# Altium project roach2_project rev2.PrjPCB (part 1 of 13)
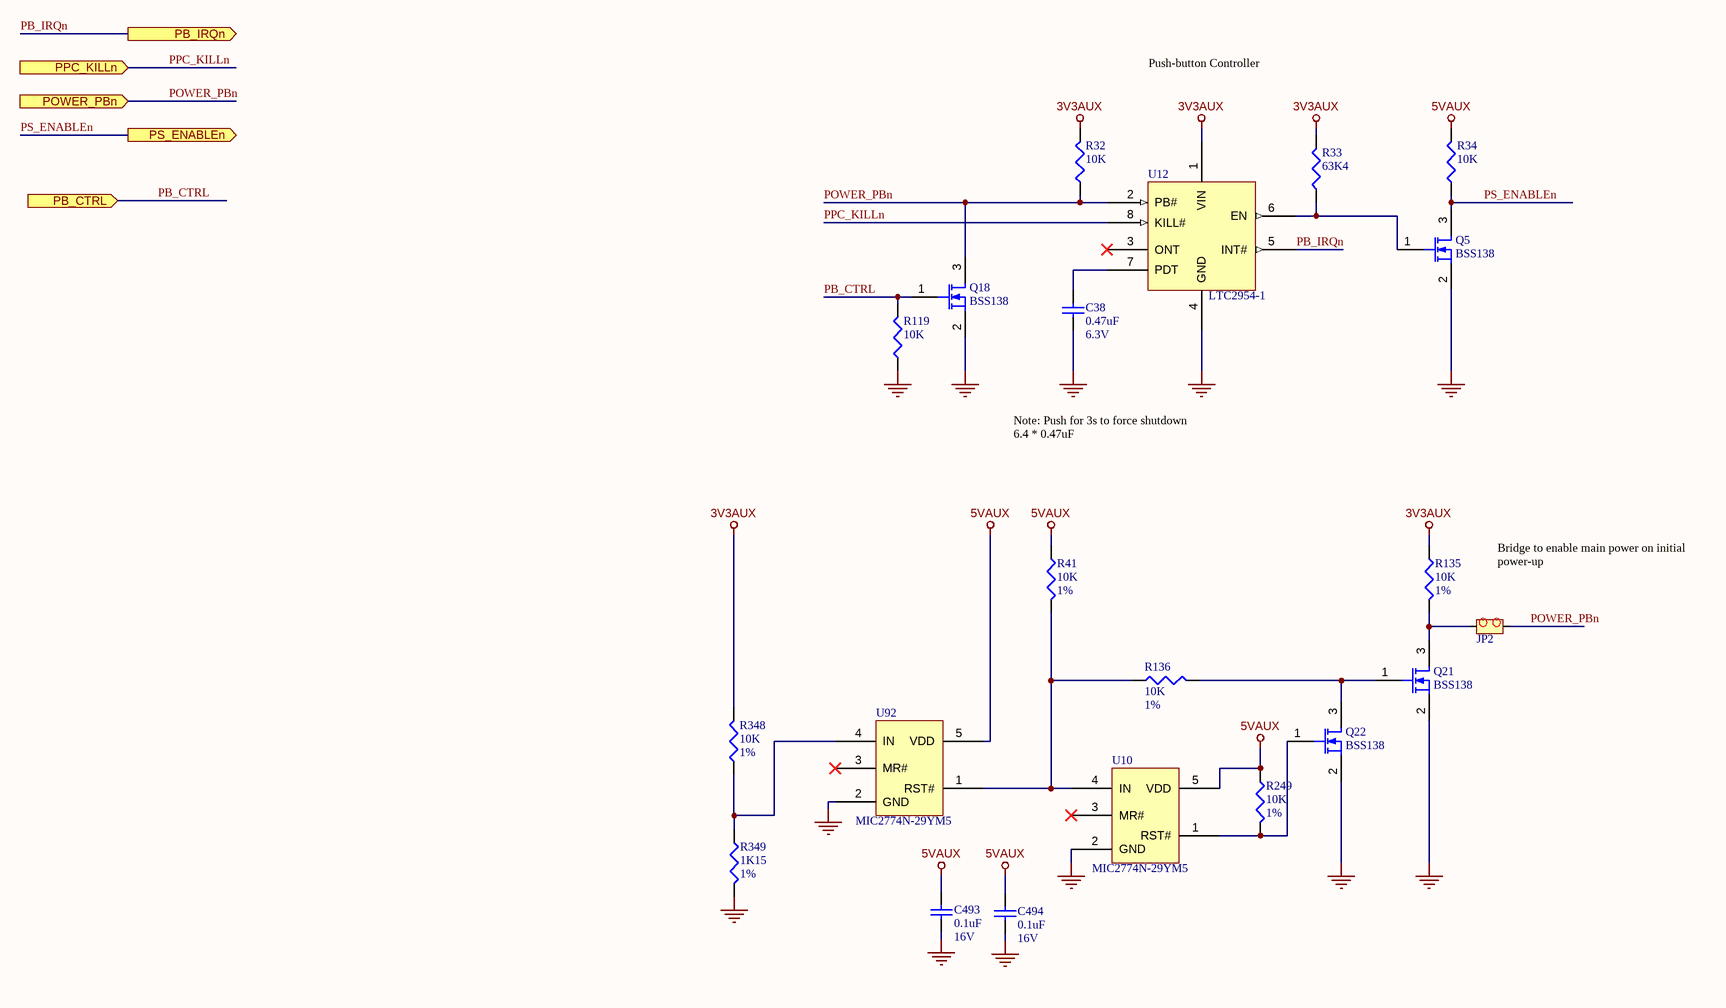
[diagram p0: hwmon_2.SchDoc]
COMPANY_ADDRESS_1: 17 Baker Street, Rosebank; COMPANY_ADDRESS_2: Johannesburg; COMPANY_ADDRESS_3: South Africa; COMPANY_NAME1: Square Kilometer Array; COMPANY_NAME2: MeerKAT; COPYRIGHT_YEAR: 2011; GERBER FILENAME: 1111-2222; PCB_REVISION: 2.A; PCB_Title_Date: 14-08-2010; PCB_Title_DocumentNumber: 1111-2222P; PCB_Title_DrawnBy: A. A.; PCB_Title_Engineer: B. B.; PCB_Title_Filename: roach2.PcbDoc; PROJECT_TITLE: ROACH 2; SCH_Title_Date: 14-2-2012; SCH_Title_DrawnBy: Philip Gibbs; SCH_Title_Engineer: David George; SCH_Title_SheetTotal: 29
25 sheets, 1337 parts. Net scope: hierarchical (ports join the sheet entries above them; power ports are global).
Board file: roach2.PcbDoc
Sheets:
  hwmon_2.SchDoc
  roach2_top.SchDoc
    DDR3 = ddr3.SchDoc
    GPIO_LED = gpio_led.SchDoc
    JTAG_LEVELXLATE = jtag_levelxlate.SchDoc
    POWER_SUPPLY = power_supply.SchDoc
    PPC_CPLD = ppc_cpld.SchDoc
    PPC_EXTBUS = ppc_extbus.SchDoc
    PPC_NET = ppc_net.SchDoc
    PPC_SERIAL = ppc_serial.SchDoc
    PPC_SYS = ppc_sys.SchDoc
    QDR0_1 = qdr0_1.SchDoc
    QDR2_3 = qdr2_3.SchDoc
    V6_CONFIG_IO_16_17_21_22 = v6_config_io_16_17_21_22.SchDoc
    V6_IO_12_13_14_15 = v6_io_12_13_14_15.SchDoc
    V6_IO_23_24_25_26 = v6_io_23_24_25_26.SchDoc
    V6_IO_27_28_32_33 = v6_io_27_28_32_33.SchDoc
    V6_IO_34_35_36_37_38 = v6_io_34_35_36_37_38.SchDoc
    ZDOKS = zdoks.SchDoc
    PPC_POWER = ppc_power.SchDoc
    MGT_BREAKOUT = mgt_breakout.SchDoc
    V6_NET = v6_net.SchDoc
    PPC_DDR_0 = ppc_ddr2_0.SchDoc
    PPC_DDR_1 = ppc_ddr2_1.SchDoc
    Miscallaneous = misc.SchDoc

## Sheet hwmon_2.SchDoc: Hardware Monitoring
size A3; Date: DO NOT USE, RATHER USE PROJ OPTIONS; DrawnBy: DO NOT USE, RATHER USE PROJ OPTIONS; Engineer: DO NOT USE, RATHER USE PROJ OPTIONS; Organization: DO NOT USE, RATHER USE PROJ OPTIONS; DocumentNumber: DO NOT USE, RATHER USE PROJ OPTIONS; Revision: DO NOT USE, RATHER USE PROJ OPTIONS; SheetNumber: 28; SheetTotal: 29; SCH_Sheet_Filename: hwmon_2.SchDoc; CurrentTime: DO NOT USE, RATHER USE PROJ OPTIONS; Time: DO NOT USE, RATHER USE PROJ OPTIONS; DocumentFullPathAndName: DO NOT USE, RATHER USE PROJ OPTIONS; DocumentName: DO NOT USE, RATHER USE PROJ OPTIONS; ModifiedDate: DO NOT USE, RATHER USE PROJ OPTIONS; ImagePath: DO NOT USE, RATHER USE PROJ OPTIONS

### Parts
(Parts that share a designator on the sheet are numbered #1, #2 ... from top to bottom, then left to right.)
C38  value 0.47uF  Rating: 6.3V  [CAPC1005X55L]  (hidden comment: CapStd)
C493  Rating: 16V  [CAPC1005X60L]  (hidden comment: 0.1uF)
C494  Rating: 16V  [CAPC1005X60L]  (hidden comment: 0.1uF)
JP2  0022032021  [MOLEX_0022032021]  (value not drawn)
Q5  BSS138  [SOT95P245X110-3N]
Q18  BSS138  [SOT95P245X110-3N]
Q21  BSS138  [SOT95P245X110-3N]
Q22  BSS138  [SOT95P245X110-3N]
R32  10K  [RESC1005X40L]
R33  63K4  [RESC1005X40L]
R34  10K  [RESC1005X40L]
R41  Tolerance: 1%  [RESC1005X40L]  (hidden comment: 10K)
R119  10K  [RESC1005X40L]
R135#1  Tolerance: 1%  [RESC1005X40L]  (hidden comment: 10K)
R136#1  Tolerance: 1%  [RESC1005X40L]  (hidden comment: 10K)
R249  Tolerance: 1%  [RESC1005X40L]  (hidden comment: 10K)
R348  Tolerance: 1%  [RESC1005X40L]  (hidden comment: 10K)
R349  Tolerance: 1%  [RESC1005X40L]  (hidden comment: 1K15)
U10  MIC2774N-29YM5  [SOT23-5]
U12  LTC2954-1  [TSOT-23-8]
U92  MIC2774N-29YM5  [SOT23-5]

### Ports
PB_CTRL (in), PB_IRQn (out), POWER_PBn (in), PPC_KILLn (in), PS_ENABLEn (out)

### Nets
3V3AUX: R32.2 R33.2 R135#1.1 R348.2 U12.1(VIN)
5VAUX: C493.2 C494.2 R34.2 R41.1 R249.1 U10.5(VDD) U92.5(VDD)
GND: C38.2 C493.1 C494.1 Q5.2(S) Q18.2(S) Q21.2(S) Q22.2(S) R119.1 R349.2 U10.2(GND) U12.4(GND) U92.2(GND)
PB_CTRL: Q18.1(G) R119.2 ; port PB_CTRL
PB_IRQn: U12.5(INT#) ; port PB_IRQn
POWER_PBn: JP2.2 Q18.3(D) R32.1 U12.2(PB#) ; port POWER_PBn
PPC_KILLn: U12.8(KILL#) ; port PPC_KILLn
PS_ENABLEn: Q5.3(D) R34.1 ; port PS_ENABLEn
NetC38_1: C38.1 U12.7(PDT)
NetJP2_1: JP2.1 Q21.3(D) R135#1.2
NetQ5_1: Q5.1(G) R33.1 U12.6(EN)
NetQ21_1: Q21.1(G) Q22.3(D) R136#1.2
NetQ22_1: Q22.1(G) R249.2 U10.1(RST#)
NetR41_2: R41.2 R136#1.1 U10.4(IN) U92.1(RST#)
NetR348_1: R348.1 R349.1 U92.4(IN)

Not connected (* = marked no-connect by the designer): U10 3(MR#)*; U12 3(ONT)*; U92 3(MR#)*

### Notes on the sheet
- Push-button Controller
- Note: Push for 3s to force shutdown
  6.4 * 0.47uF
- Bridge to enable main power on initial power-up
- 2009   THIS DOCUMENT IS THE PROPERTY OF THE OWNER, AND MAY NOT BE COPIED OR USED FOR ANY PURPOSE OTHER THAN THAT FOR WHICH IT IS SUPPLIED WITHOUT PERMISSION IN WRITING FROM THE OWNER.
- C
- DATESTAMP OF THIS PRINT
- DRAWN BY:
- DOCUMENT NUMBER:
- SCHEMATIC FILENAME:
- PCB FILENAME:
- ENGINEER:
- APPROVED:
- CIRCUIT DIAGRAM
- DATE
- SHEET
- REVISION
- OF

### Library data of the parts
C38 = CAP-CER-7: 0.47uF, Ceramic Capacitor; POD number: CAP-CER-7
C493 C494 = CAP-CER-1: 0.1uF, Ceramic Capacitor; Manufacturer: VENKEL; PartNum: C0402X7R160-104KN; Tolerance: 10%; Dielectric: X7R; POD number: CAP-CER-1; Value: 0.1uF; RoHS: Y; Sort Value: 0.1; Category: Capacitors; Subcategory: Ceramic
JP2 = CONN-PCB-14: 1x2, 2.56mm, Header/Jumper; Manufacturer: Molex; POD number: CONN-PCB-14; PartNum: 0022032021; RoHS: Y; Category: CONN; Subcategory: PCB
Q5 Q18 Q21 Q22 = TRANS-NFET-0: N-Channel Logic Level Enhancement Mode Field Effect Transistor; Manufacturer: Fairchild Semiconductor; Rating: 0.22A; POD number: TRANS-NFET-0; PartNum: BSS138; RoHS: Y; Category: TRANS; Subcategory: NFET
R32 R34 R119 = RES-TF-5: 10K, 1.1mm x 0.5mm, Thick Film Resistor; Manufacturer: ROYALOHM; PartNum: 0402WGJ0103T1E; Tolerance: 5%; Rating: 0.0625W; POD number: RES-TF-5; Value: 10K; Sort Value: 10000; Category: Resistors; Subcategory: ThickFilm; HelpURL: *.pdf
R33 = RES-TF-33: 63K4, 1.1mm x 0.5mm, Thick Film Resistor; Manufacturer: ROYALOHM; PartNum: 0402WGF6342T1E; Tolerance: 1%; Rating: 0.0625W; POD number: RES-TF-33; Value: 63K4; Sort Value: 63400; Category: Resistors; Subcategory: ThickFilm; HelpURL: *.pdf
R41 R135#1 R136#1 R249 R348 = RES-TF-20: 10K, 1.1mm x 0.5mm, Thick Film Resistor; Manufacturer: ROYALOHM; PartNum: 0402WGF0103T1E; Rating: 0.0625W; POD number: RES-TF-20; Value: 10K; Sort Value: 10000; Category: Resistors; Subcategory: ThickFilm; HelpURL: http://www.royalohm.com/pdf/general.pdf
R349 = RES-TF-28: 1K15, 1.1mm x 0.5mm, Thick Film Resistor; Manufacturer: ROYALOHM; PartNum: 0402WGF1150T1E; Rating: 0.0625W; POD number: RES-TF-28; Value: 1K15; Sort Value: 1150; Category: Resistors; Subcategory: ThickFilm; HelpURL: *.pdf
U10 U92 = IC-MON-4: Dual-power low voltage supervisor; Manufacturer: Micrel; POD number: IC-MON-4; PartNum: MIC2774N-29YM5; RoHS: Y; Category: IC; Subcategory: Monitoring
U12 = IC-MON-8: Push Button On/Off Controller; POD number: IC-MON-8

## Sheet roach2_top.SchDoc: Design Toplevel
size A3; Date: DO NOT USE, RATHER USE PROJ OPTIONS; DrawnBy: DO NOT USE, RATHER USE PROJ OPTIONS; Engineer: DO NOT USE, RATHER USE PROJ OPTIONS; Organization: DO NOT USE, RATHER USE PROJ OPTIONS; DocumentNumber: DO NOT USE, RATHER USE PROJ OPTIONS; Revision: DO NOT USE, RATHER USE PROJ OPTIONS; SheetNumber: 1; SheetTotal: 27; SCH_Sheet_Filename: <roach2_top.SchDoc>; CurrentTime: DO NOT USE, RATHER USE PROJ OPTIONS; Time: DO NOT USE, RATHER USE PROJ OPTIONS; DocumentFullPathAndName: DO NOT USE, RATHER USE PROJ OPTIONS; DocumentName: DO NOT USE, RATHER USE PROJ OPTIONS; ModifiedDate: DO NOT USE, RATHER USE PROJ OPTIONS; ImagePath: DO NOT USE, RATHER USE PROJ OPTIONS
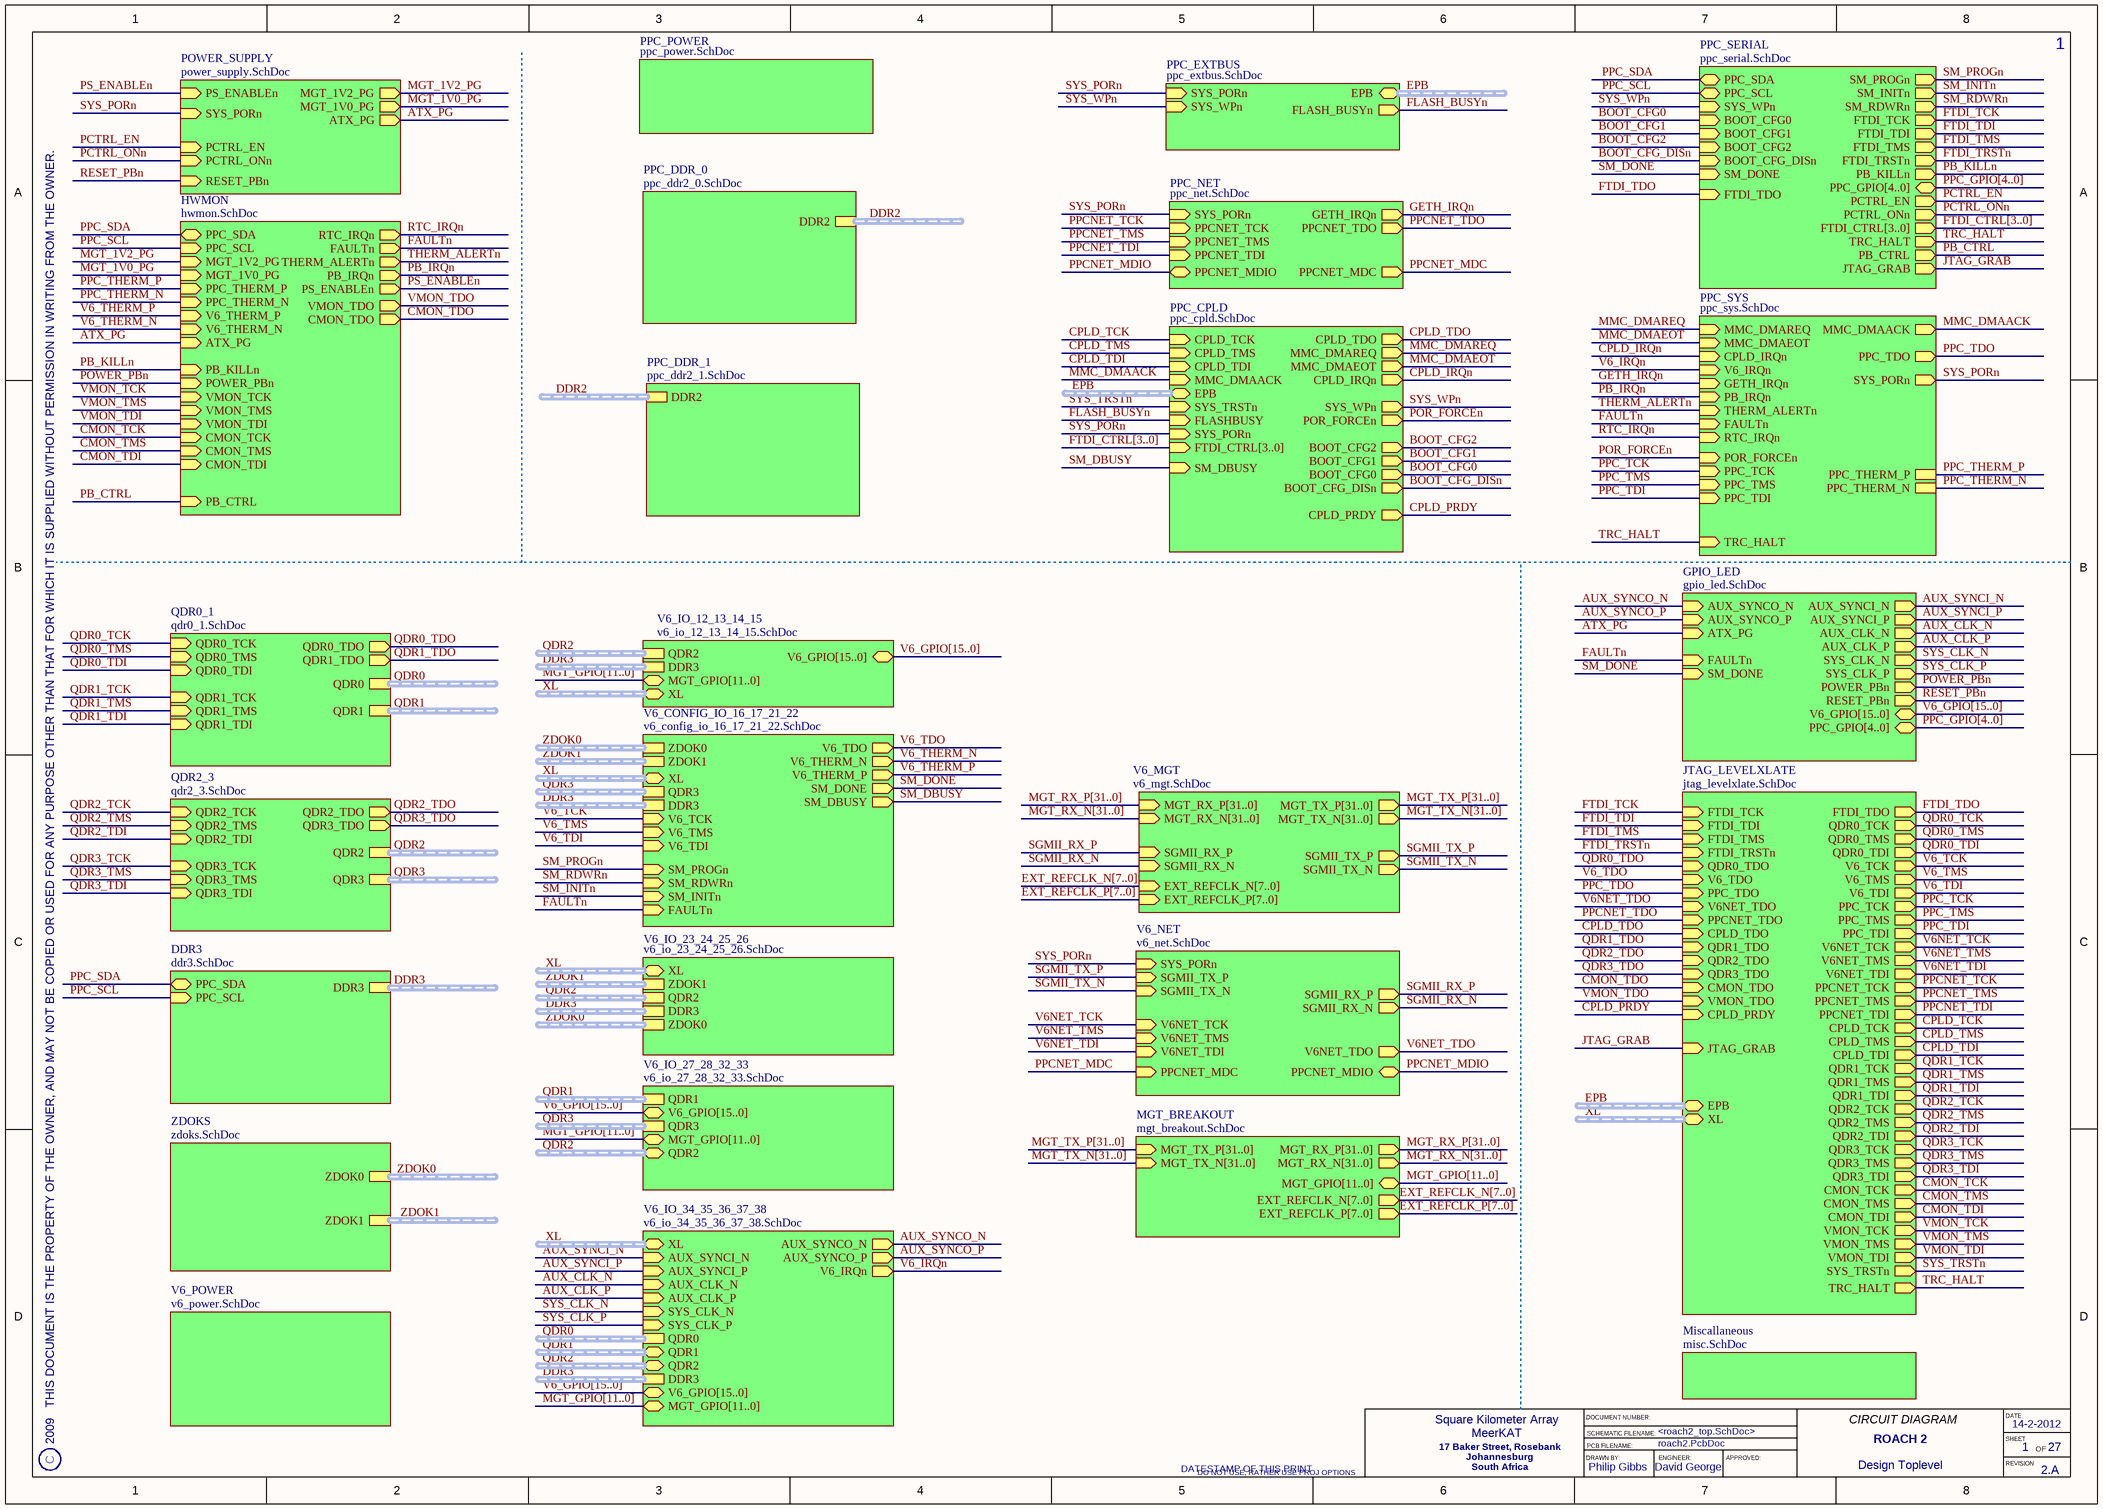
[diagram p1: roach2_top.SchDoc]

### Sub-sheets
DDR3 = ddr3.SchDoc: DDR3 (harness DDR3), PPC_SDA (bidir), PPC_SCL (in)
GPIO_LED = gpio_led.SchDoc: V6_GPIO[15..0] (bidir), AUX_SYNCO_N (in), AUX_SYNCO_P (in), AUX_SYNCI_N (out), AUX_SYNCI_P (out), AUX_CLK_N (out), AUX_CLK_P (out), POWER_PBn (out), ATX_PG (in), RESET_PBn (out), PPC_GPIO[4..0] (bidir), SYS_CLK_N (out), SYS_CLK_P (out), SM_DONE (in), FAULTn (in)
HWMON = hwmon.SchDoc (file not in this document): PPC_SDA (bidir), PPC_SCL (in), RTC_IRQn (out), MGT_1V2_PG (in), MGT_1V0_PG (in), PPC_THERM_P (in), PPC_THERM_N (in), V6_THERM_P (in), V6_THERM_N (in), FAULTn (out), THERM_ALERTn (out), ATX_PG (in), PB_IRQn (out), PB_KILLn (in), POWER_PBn (in), PS_ENABLEn (out), VMON_TDO (out), CMON_TDO (out), VMON_TCK (in), VMON_TMS (in), VMON_TDI (in), CMON_TCK (in), CMON_TMS (in), CMON_TDI (in), PB_CTRL (in)
JTAG_LEVELXLATE = jtag_levelxlate.SchDoc: FTDI_TCK (in), FTDI_TDI (in), FTDI_TMS (in), FTDI_TRSTn (in), FTDI_TDO (out), QDR0_TCK (out), QDR0_TMS (out), QDR0_TDI (out), QDR0_TDO (in), V6_TCK (out), V6_TDI (out), V6_TMS (out), V6_TDO (in), PPC_TDI (out), PPC_TDO (in), PPC_TMS (out), PPC_TCK (out), V6NET_TDI (out), V6NET_TDO (in), V6NET_TCK (out), V6NET_TMS (out), PPCNET_TDI (out), PPCNET_TDO (in), PPCNET_TCK (out), PPCNET_TMS (out), CPLD_TDI (out), CPLD_TDO (in), CPLD_TCK (out), CPLD_TMS (out), QDR1_TCK (out), QDR1_TMS (out), QDR1_TDI (out), QDR1_TDO (in), QDR2_TCK (out), QDR2_TMS (out), QDR2_TDI (out), QDR2_TDO (in), QDR3_TCK (out), QDR3_TMS (out), QDR3_TDI (out), QDR3_TDO (in), SYS_TRSTn (out), CMON_TMS (out), VMON_TMS (out), CMON_TCK (out), VMON_TCK (out), CMON_TDO (in), VMON_TDO (in), CMON_TDI (out), VMON_TDI (out), EPB (harness EPB), XL (harness XL), CPLD_PRDY (in), TRC_HALT (out), JTAG_GRAB (in)
MGT_BREAKOUT = mgt_breakout.SchDoc: MGT_RX_P[31..0] (out), MGT_RX_N[31..0] (out), MGT_TX_P[31..0] (in), MGT_TX_N[31..0] (in), MGT_GPIO[11..0] (bidir), EXT_REFCLK_N[7..0] (out), EXT_REFCLK_P[7..0] (out)
Miscallaneous = misc.SchDoc: no entries
POWER_SUPPLY = power_supply.SchDoc: PS_ENABLEn (in), MGT_1V2_PG (out), MGT_1V0_PG (out), ATX_PG (out), SYS_PORn (in), PCTRL_EN (in), PCTRL_ONn (in), RESET_PBn (in)
PPC_CPLD = ppc_cpld.SchDoc: CPLD_TDI (in), CPLD_TDO (out), CPLD_TCK (in), CPLD_TMS (in), MMC_DMAREQ (out), MMC_DMAACK (in), MMC_DMAEOT (out), CPLD_IRQn (out), SYS_TRSTn (in), SYS_WPn (out), FLASHBUSY (in), POR_FORCEn (out), BOOT_CFG_DISn (out), BOOT_CFG2 (out), BOOT_CFG1 (out), BOOT_CFG0 (out), SYS_PORn (in), EPB (harness EPB), FTDI_CTRL[3..0] (in), CPLD_PRDY (out), SM_DBUSY (in)
PPC_DDR_0 = ppc_ddr2_0.SchDoc: DDR2 (harness DDR2)
PPC_DDR_1 = ppc_ddr2_1.SchDoc: DDR2 (harness DDR2)
PPC_EXTBUS = ppc_extbus.SchDoc: SYS_PORn (in), SYS_WPn (in), FLASH_BUSYn (out), EPB (harness EPB)
PPC_NET = ppc_net.SchDoc: SYS_PORn (in), GETH_IRQn (out), PPCNET_TDI (in), PPCNET_TDO (out), PPCNET_TCK (in), PPCNET_TMS (in), PPCNET_MDIO (bidir), PPCNET_MDC (out)
PPC_POWER = ppc_power.SchDoc: no entries
PPC_SERIAL = ppc_serial.SchDoc: PPC_SDA (bidir), PPC_SCL (bidir), SYS_WPn (in), BOOT_CFG0 (in), BOOT_CFG1 (in), BOOT_CFG2 (in), BOOT_CFG_DISn (in), SM_PROGn (out), SM_INITn (out), SM_RDWRn (out), FTDI_TCK (out), FTDI_TDI (out), FTDI_TDO (in), FTDI_TMS (out), FTDI_TRSTn (out), PPC_GPIO[4..0] (bidir), SM_DONE (in), PCTRL_EN (out), PCTRL_ONn (out), PB_KILLn (out), FTDI_CTRL[3..0] (out), TRC_HALT (out), PB_CTRL (out), JTAG_GRAB (out)
PPC_SYS = ppc_sys.SchDoc: MMC_DMAREQ (in), MMC_DMAACK (out), MMC_DMAEOT (in), CPLD_IRQn (in), V6_IRQn (in), GETH_IRQn (in), THERM_ALERTn (in), PPC_THERM_P, PPC_THERM_N, POR_FORCEn (in), PPC_TCK (in), PPC_TDO (out), PPC_TMS (in), PPC_TDI (in), FAULTn (in), SYS_PORn (out), PB_IRQn (in), RTC_IRQn (in), TRC_HALT (in)
QDR0_1 = qdr0_1.SchDoc: QDR0 (harness QDR0), QDR0_TCK (in), QDR0_TMS (in), QDR0_TDI (in), QDR0_TDO (out), QDR1 (harness QDR1), QDR1_TCK (in), QDR1_TMS (in), QDR1_TDI (in), QDR1_TDO (out)
QDR2_3 = qdr2_3.SchDoc: QDR2 (harness QDR2), QDR2_TCK (in), QDR2_TMS (in), QDR2_TDI (in), QDR2_TDO (out), QDR3 (harness QDR3), QDR3_TCK (in), QDR3_TMS (in), QDR3_TDI (in), QDR3_TDO (out)
V6_CONFIG_IO_16_17_21_22 = v6_config_io_16_17_21_22.SchDoc: ZDOK0 (harness ZDOK0), QDR3 (harness QDR3), DDR3 (harness DDR3), V6_TCK (in), V6_TDI (in), V6_TMS (in), V6_TDO (out), V6_THERM_N (out), V6_THERM_P (out), SM_PROGn (in), SM_RDWRn (in), SM_INITn (in), SM_DONE (out), XL (harness XL), FAULTn (in), ZDOK1 (harness ZDOK1), SM_DBUSY (out)
V6_IO_12_13_14_15 = v6_io_12_13_14_15.SchDoc: QDR2 (harness QDR2), DDR3 (harness DDR3), MGT_GPIO[11..0] (bidir), XL (harness XL), V6_GPIO[15..0] (bidir)
V6_IO_23_24_25_26 = v6_io_23_24_25_26.SchDoc: ZDOK1 (harness ZDOK1), QDR2 (harness QDR2), DDR3 (harness DDR3), ZDOK0 (harness ZDOK0), XL (harness XL)
V6_IO_27_28_32_33 = v6_io_27_28_32_33.SchDoc: QDR1 (harness QDR1), V6_GPIO[15..0] (bidir), QDR3 (harness QDR3), MGT_GPIO[11..0] (bidir), QDR2 (harness QDR2)
V6_IO_34_35_36_37_38 = v6_io_34_35_36_37_38.SchDoc: AUX_SYNCO_N (out), AUX_SYNCO_P (out), AUX_SYNCI_N (in), AUX_SYNCI_P (in), V6_IRQn (out), AUX_CLK_N (in), AUX_CLK_P (in), SYS_CLK_N (in), SYS_CLK_P (in), QDR0 (harness QDR0), V6_GPIO[15..0] (bidir), MGT_GPIO[11..0] (bidir), QDR2 (harness QDR2), DDR3 (harness DDR3), QDR1 (harness QDR1), XL (harness XL)
V6_MGT = v6_mgt.SchDoc (file not in this document): MGT_RX_P[31..0] (in), MGT_RX_N[31..0] (in), MGT_TX_P[31..0] (out), MGT_TX_N[31..0] (out), SGMII_RX_P (in), SGMII_RX_N (in), SGMII_TX_P (out), SGMII_TX_N (out), EXT_REFCLK_N[7..0] (in), EXT_REFCLK_P[7..0] (in)
V6_NET = v6_net.SchDoc: SYS_PORn (in), SGMII_TX_P (in), SGMII_TX_N (in), V6NET_TDI (in), V6NET_TDO (out), V6NET_TCK (in), V6NET_TMS (in), SGMII_RX_P (out), SGMII_RX_N (out), PPCNET_MDIO (bidir), PPCNET_MDC (in)
V6_POWER = v6_power.SchDoc (file not in this document): no entries
ZDOKS = zdoks.SchDoc: ZDOK0 (harness ZDOK0), ZDOK1 (harness ZDOK1)

### Nets
ATX_PG: sheet GPIO_LED/ATX_PG, sheet HWMON/ATX_PG, sheet POWER_SUPPLY/ATX_PG
AUX_CLK_N: sheet GPIO_LED/AUX_CLK_N, sheet V6_IO_34_35_36_37_38/AUX_CLK_N
AUX_CLK_P: sheet GPIO_LED/AUX_CLK_P, sheet V6_IO_34_35_36_37_38/AUX_CLK_P
AUX_SYNCI_N: sheet GPIO_LED/AUX_SYNCI_N, sheet V6_IO_34_35_36_37_38/AUX_SYNCI_N
AUX_SYNCI_P: sheet GPIO_LED/AUX_SYNCI_P, sheet V6_IO_34_35_36_37_38/AUX_SYNCI_P
AUX_SYNCO_N: sheet GPIO_LED/AUX_SYNCO_N, sheet V6_IO_34_35_36_37_38/AUX_SYNCO_N
AUX_SYNCO_P: sheet GPIO_LED/AUX_SYNCO_P, sheet V6_IO_34_35_36_37_38/AUX_SYNCO_P
BOOT_CFG0: sheet PPC_CPLD/BOOT_CFG0, sheet PPC_SERIAL/BOOT_CFG0
BOOT_CFG1: sheet PPC_CPLD/BOOT_CFG1, sheet PPC_SERIAL/BOOT_CFG1
BOOT_CFG2: sheet PPC_CPLD/BOOT_CFG2, sheet PPC_SERIAL/BOOT_CFG2
BOOT_CFG_DISn: sheet PPC_CPLD/BOOT_CFG_DISn, sheet PPC_SERIAL/BOOT_CFG_DISn
CMON_TCK: sheet HWMON/CMON_TCK, sheet JTAG_LEVELXLATE/CMON_TCK
CMON_TDI: sheet HWMON/CMON_TDI, sheet JTAG_LEVELXLATE/CMON_TDI
CMON_TDO: sheet HWMON/CMON_TDO, sheet JTAG_LEVELXLATE/CMON_TDO
CMON_TMS: sheet HWMON/CMON_TMS, sheet JTAG_LEVELXLATE/CMON_TMS
CPLD_IRQn: sheet PPC_CPLD/CPLD_IRQn, sheet PPC_SYS/CPLD_IRQn
CPLD_PRDY: sheet JTAG_LEVELXLATE/CPLD_PRDY, sheet PPC_CPLD/CPLD_PRDY
CPLD_TCK: sheet JTAG_LEVELXLATE/CPLD_TCK, sheet PPC_CPLD/CPLD_TCK
CPLD_TDI: sheet JTAG_LEVELXLATE/CPLD_TDI, sheet PPC_CPLD/CPLD_TDI
CPLD_TDO: sheet JTAG_LEVELXLATE/CPLD_TDO, sheet PPC_CPLD/CPLD_TDO
CPLD_TMS: sheet JTAG_LEVELXLATE/CPLD_TMS, sheet PPC_CPLD/CPLD_TMS
FAULTn: sheet GPIO_LED/FAULTn, sheet HWMON/FAULTn, sheet PPC_SYS/FAULTn, sheet V6_CONFIG_IO_16_17_21_22/FAULTn
FLASH_BUSYn: sheet PPC_CPLD/FLASHBUSY, sheet PPC_EXTBUS/FLASH_BUSYn
FTDI_TCK: sheet JTAG_LEVELXLATE/FTDI_TCK, sheet PPC_SERIAL/FTDI_TCK
FTDI_TDI: sheet JTAG_LEVELXLATE/FTDI_TDI, sheet PPC_SERIAL/FTDI_TDI
FTDI_TDO: sheet JTAG_LEVELXLATE/FTDI_TDO, sheet PPC_SERIAL/FTDI_TDO
FTDI_TMS: sheet JTAG_LEVELXLATE/FTDI_TMS, sheet PPC_SERIAL/FTDI_TMS
FTDI_TRSTn: sheet JTAG_LEVELXLATE/FTDI_TRSTn, sheet PPC_SERIAL/FTDI_TRSTn
GETH_IRQn: sheet PPC_NET/GETH_IRQn, sheet PPC_SYS/GETH_IRQn
JTAG_GRAB: sheet JTAG_LEVELXLATE/JTAG_GRAB, sheet PPC_SERIAL/JTAG_GRAB
MGT_1V0_PG: sheet HWMON/MGT_1V0_PG, sheet POWER_SUPPLY/MGT_1V0_PG
MGT_1V2_PG: sheet HWMON/MGT_1V2_PG, sheet POWER_SUPPLY/MGT_1V2_PG
MMC_DMAACK: sheet PPC_CPLD/MMC_DMAACK, sheet PPC_SYS/MMC_DMAACK
MMC_DMAEOT: sheet PPC_CPLD/MMC_DMAEOT, sheet PPC_SYS/MMC_DMAEOT
MMC_DMAREQ: sheet PPC_CPLD/MMC_DMAREQ, sheet PPC_SYS/MMC_DMAREQ
PB_CTRL: sheet HWMON/PB_CTRL, sheet PPC_SERIAL/PB_CTRL
PB_IRQn: sheet HWMON/PB_IRQn, sheet PPC_SYS/PB_IRQn
PB_KILLn: sheet HWMON/PB_KILLn, sheet PPC_SERIAL/PB_KILLn
PCTRL_EN: sheet POWER_SUPPLY/PCTRL_EN, sheet PPC_SERIAL/PCTRL_EN
PCTRL_ONn: sheet POWER_SUPPLY/PCTRL_ONn, sheet PPC_SERIAL/PCTRL_ONn
POR_FORCEn: sheet PPC_CPLD/POR_FORCEn, sheet PPC_SYS/POR_FORCEn
POWER_PBn: sheet GPIO_LED/POWER_PBn, sheet HWMON/POWER_PBn
PPC_SCL: sheet DDR3/PPC_SCL, sheet HWMON/PPC_SCL, sheet PPC_SERIAL/PPC_SCL
PPC_SDA: sheet DDR3/PPC_SDA, sheet HWMON/PPC_SDA, sheet PPC_SERIAL/PPC_SDA
PPC_TCK: sheet JTAG_LEVELXLATE/PPC_TCK, sheet PPC_SYS/PPC_TCK
PPC_TDI: sheet JTAG_LEVELXLATE/PPC_TDI, sheet PPC_SYS/PPC_TDI
PPC_TDO: sheet JTAG_LEVELXLATE/PPC_TDO, sheet PPC_SYS/PPC_TDO
PPC_THERM_N: sheet HWMON/PPC_THERM_N, sheet PPC_SYS/PPC_THERM_N
PPC_THERM_P: sheet HWMON/PPC_THERM_P, sheet PPC_SYS/PPC_THERM_P
PPC_TMS: sheet JTAG_LEVELXLATE/PPC_TMS, sheet PPC_SYS/PPC_TMS
PPCNET_MDC: sheet PPC_NET/PPCNET_MDC, sheet V6_NET/PPCNET_MDC
PPCNET_MDIO: sheet PPC_NET/PPCNET_MDIO, sheet V6_NET/PPCNET_MDIO
PPCNET_TCK: sheet JTAG_LEVELXLATE/PPCNET_TCK, sheet PPC_NET/PPCNET_TCK
PPCNET_TDI: sheet JTAG_LEVELXLATE/PPCNET_TDI, sheet PPC_NET/PPCNET_TDI
PPCNET_TDO: sheet JTAG_LEVELXLATE/PPCNET_TDO, sheet PPC_NET/PPCNET_TDO
PPCNET_TMS: sheet JTAG_LEVELXLATE/PPCNET_TMS, sheet PPC_NET/PPCNET_TMS
PS_ENABLEn: sheet HWMON/PS_ENABLEn, sheet POWER_SUPPLY/PS_ENABLEn
QDR0_TCK: sheet JTAG_LEVELXLATE/QDR0_TCK, sheet QDR0_1/QDR0_TCK
QDR0_TDI: sheet JTAG_LEVELXLATE/QDR0_TDI, sheet QDR0_1/QDR0_TDI
QDR0_TDO: sheet JTAG_LEVELXLATE/QDR0_TDO, sheet QDR0_1/QDR0_TDO
QDR0_TMS: sheet JTAG_LEVELXLATE/QDR0_TMS, sheet QDR0_1/QDR0_TMS
QDR1_TCK: sheet JTAG_LEVELXLATE/QDR1_TCK, sheet QDR0_1/QDR1_TCK
QDR1_TDI: sheet JTAG_LEVELXLATE/QDR1_TDI, sheet QDR0_1/QDR1_TDI
QDR1_TDO: sheet JTAG_LEVELXLATE/QDR1_TDO, sheet QDR0_1/QDR1_TDO
QDR1_TMS: sheet JTAG_LEVELXLATE/QDR1_TMS, sheet QDR0_1/QDR1_TMS
QDR2_TCK: sheet JTAG_LEVELXLATE/QDR2_TCK, sheet QDR2_3/QDR2_TCK
QDR2_TDI: sheet JTAG_LEVELXLATE/QDR2_TDI, sheet QDR2_3/QDR2_TDI
QDR2_TDO: sheet JTAG_LEVELXLATE/QDR2_TDO, sheet QDR2_3/QDR2_TDO
QDR2_TMS: sheet JTAG_LEVELXLATE/QDR2_TMS, sheet QDR2_3/QDR2_TMS
QDR3_TCK: sheet JTAG_LEVELXLATE/QDR3_TCK, sheet QDR2_3/QDR3_TCK
QDR3_TDI: sheet JTAG_LEVELXLATE/QDR3_TDI, sheet QDR2_3/QDR3_TDI
QDR3_TDO: sheet JTAG_LEVELXLATE/QDR3_TDO, sheet QDR2_3/QDR3_TDO
QDR3_TMS: sheet JTAG_LEVELXLATE/QDR3_TMS, sheet QDR2_3/QDR3_TMS
RESET_PBn: sheet GPIO_LED/RESET_PBn, sheet POWER_SUPPLY/RESET_PBn
RTC_IRQn: sheet HWMON/RTC_IRQn, sheet PPC_SYS/RTC_IRQn
SGMII_RX_N: sheet V6_MGT/SGMII_RX_N, sheet V6_NET/SGMII_RX_N
SGMII_RX_P: sheet V6_MGT/SGMII_RX_P, sheet V6_NET/SGMII_RX_P
SGMII_TX_N: sheet V6_MGT/SGMII_TX_N, sheet V6_NET/SGMII_TX_N
SGMII_TX_P: sheet V6_MGT/SGMII_TX_P, sheet V6_NET/SGMII_TX_P
SM_DBUSY: sheet PPC_CPLD/SM_DBUSY, sheet V6_CONFIG_IO_16_17_21_22/SM_DBUSY
SM_DONE: sheet GPIO_LED/SM_DONE, sheet PPC_SERIAL/SM_DONE, sheet V6_CONFIG_IO_16_17_21_22/SM_DONE
SM_INITn: sheet PPC_SERIAL/SM_INITn, sheet V6_CONFIG_IO_16_17_21_22/SM_INITn
SM_PROGn: sheet PPC_SERIAL/SM_PROGn, sheet V6_CONFIG_IO_16_17_21_22/SM_PROGn
SM_RDWRn: sheet PPC_SERIAL/SM_RDWRn, sheet V6_CONFIG_IO_16_17_21_22/SM_RDWRn
SYS_CLK_N: sheet GPIO_LED/SYS_CLK_N, sheet V6_IO_34_35_36_37_38/SYS_CLK_N
SYS_CLK_P: sheet GPIO_LED/SYS_CLK_P, sheet V6_IO_34_35_36_37_38/SYS_CLK_P
SYS_PORn: sheet POWER_SUPPLY/SYS_PORn, sheet PPC_CPLD/SYS_PORn, sheet PPC_EXTBUS/SYS_PORn, sheet PPC_NET/SYS_PORn, sheet PPC_SYS/SYS_PORn, sheet V6_NET/SYS_PORn
SYS_TRSTn: sheet JTAG_LEVELXLATE/SYS_TRSTn, sheet PPC_CPLD/SYS_TRSTn
SYS_WPn: sheet PPC_CPLD/SYS_WPn, sheet PPC_EXTBUS/SYS_WPn, sheet PPC_SERIAL/SYS_WPn
THERM_ALERTn: sheet HWMON/THERM_ALERTn, sheet PPC_SYS/THERM_ALERTn
TRC_HALT: sheet JTAG_LEVELXLATE/TRC_HALT, sheet PPC_SERIAL/TRC_HALT, sheet PPC_SYS/TRC_HALT
V6_IRQn: sheet PPC_SYS/V6_IRQn, sheet V6_IO_34_35_36_37_38/V6_IRQn
V6_TCK: sheet JTAG_LEVELXLATE/V6_TCK, sheet V6_CONFIG_IO_16_17_21_22/V6_TCK
V6_TDI: sheet JTAG_LEVELXLATE/V6_TDI, sheet V6_CONFIG_IO_16_17_21_22/V6_TDI
V6_TDO: sheet JTAG_LEVELXLATE/V6_TDO, sheet V6_CONFIG_IO_16_17_21_22/V6_TDO
V6_THERM_N: sheet HWMON/V6_THERM_N, sheet V6_CONFIG_IO_16_17_21_22/V6_THERM_N
V6_THERM_P: sheet HWMON/V6_THERM_P, sheet V6_CONFIG_IO_16_17_21_22/V6_THERM_P
V6_TMS: sheet JTAG_LEVELXLATE/V6_TMS, sheet V6_CONFIG_IO_16_17_21_22/V6_TMS
V6NET_TCK: sheet JTAG_LEVELXLATE/V6NET_TCK, sheet V6_NET/V6NET_TCK
V6NET_TDI: sheet JTAG_LEVELXLATE/V6NET_TDI, sheet V6_NET/V6NET_TDI
V6NET_TDO: sheet JTAG_LEVELXLATE/V6NET_TDO, sheet V6_NET/V6NET_TDO
V6NET_TMS: sheet JTAG_LEVELXLATE/V6NET_TMS, sheet V6_NET/V6NET_TMS
VMON_TCK: sheet HWMON/VMON_TCK, sheet JTAG_LEVELXLATE/VMON_TCK
VMON_TDI: sheet HWMON/VMON_TDI, sheet JTAG_LEVELXLATE/VMON_TDI
VMON_TDO: sheet HWMON/VMON_TDO, sheet JTAG_LEVELXLATE/VMON_TDO
VMON_TMS: sheet HWMON/VMON_TMS, sheet JTAG_LEVELXLATE/VMON_TMS

### Buses and harness runs
bus EXT_REFCLK_N[7..0] = sheet MGT_BREAKOUT/EXT_REFCLK_N[7..0]
bus EXT_REFCLK_N[7..0] = sheet V6_MGT/EXT_REFCLK_N[7..0]
bus EXT_REFCLK_P[7..0] = sheet MGT_BREAKOUT/EXT_REFCLK_P[7..0]
bus EXT_REFCLK_P[7..0] = sheet V6_MGT/EXT_REFCLK_P[7..0]
bus FTDI_CTRL[3..0] = sheet PPC_CPLD/FTDI_CTRL[3..0]
bus FTDI_CTRL[3..0] = sheet PPC_SERIAL/FTDI_CTRL[3..0]
bus MGT_GPIO[11..0] = sheet MGT_BREAKOUT/MGT_GPIO[11..0]
bus MGT_GPIO[11..0] = sheet V6_IO_12_13_14_15/MGT_GPIO[11..0]
bus MGT_GPIO[11..0] = sheet V6_IO_27_28_32_33/MGT_GPIO[11..0]
bus MGT_GPIO[11..0] = sheet V6_IO_34_35_36_37_38/MGT_GPIO[11..0]
bus MGT_RX_N[31..0] = sheet MGT_BREAKOUT/MGT_RX_N[31..0]
bus MGT_RX_N[31..0] = sheet V6_MGT/MGT_RX_N[31..0]
bus MGT_RX_P[31..0] = sheet MGT_BREAKOUT/MGT_RX_P[31..0]
bus MGT_RX_P[31..0] = sheet V6_MGT/MGT_RX_P[31..0]
bus MGT_TX_N[31..0] = sheet MGT_BREAKOUT/MGT_TX_N[31..0]
bus MGT_TX_N[31..0] = sheet V6_MGT/MGT_TX_N[31..0]
bus MGT_TX_P[31..0] = sheet MGT_BREAKOUT/MGT_TX_P[31..0]
bus MGT_TX_P[31..0] = sheet V6_MGT/MGT_TX_P[31..0]
bus PPC_GPIO[4..0] = sheet GPIO_LED/PPC_GPIO[4..0]
bus PPC_GPIO[4..0] = sheet PPC_SERIAL/PPC_GPIO[4..0]
bus V6_GPIO[15..0] = sheet GPIO_LED/V6_GPIO[15..0]
bus V6_GPIO[15..0] = sheet V6_IO_12_13_14_15/V6_GPIO[15..0]
bus V6_GPIO[15..0] = sheet V6_IO_27_28_32_33/V6_GPIO[15..0]
bus V6_GPIO[15..0] = sheet V6_IO_34_35_36_37_38/V6_GPIO[15..0]
harness DDR2 = sheet PPC_DDR_0/DDR2
harness DDR2 = sheet PPC_DDR_1/DDR2
harness DDR3 = sheet DDR3/DDR3
harness DDR3 = sheet V6_CONFIG_IO_16_17_21_22/DDR3
harness DDR3 = sheet V6_IO_12_13_14_15/DDR3
harness DDR3 = sheet V6_IO_23_24_25_26/DDR3
harness DDR3 = sheet V6_IO_34_35_36_37_38/DDR3
harness EPB = sheet JTAG_LEVELXLATE/EPB
harness EPB = sheet PPC_CPLD/EPB
harness EPB = sheet PPC_EXTBUS/EPB
harness QDR0 = sheet QDR0_1/QDR0
harness QDR0 = sheet V6_IO_34_35_36_37_38/QDR0
harness QDR1 = sheet QDR0_1/QDR1
harness QDR1 = sheet V6_IO_27_28_32_33/QDR1
harness QDR1 = sheet V6_IO_34_35_36_37_38/QDR1
harness QDR2 = sheet QDR2_3/QDR2
harness QDR2 = sheet V6_IO_12_13_14_15/QDR2
harness QDR2 = sheet V6_IO_23_24_25_26/QDR2
harness QDR2 = sheet V6_IO_27_28_32_33/QDR2
harness QDR2 = sheet V6_IO_34_35_36_37_38/QDR2
harness QDR3 = sheet QDR2_3/QDR3
harness QDR3 = sheet V6_CONFIG_IO_16_17_21_22/QDR3
harness QDR3 = sheet V6_IO_27_28_32_33/QDR3
harness XL = sheet JTAG_LEVELXLATE/XL
harness XL = sheet V6_CONFIG_IO_16_17_21_22/XL
harness XL = sheet V6_IO_12_13_14_15/XL
harness XL = sheet V6_IO_23_24_25_26/XL
harness XL = sheet V6_IO_34_35_36_37_38/XL
harness ZDOK0 = sheet V6_CONFIG_IO_16_17_21_22/ZDOK0
harness ZDOK0 = sheet V6_IO_23_24_25_26/ZDOK0
harness ZDOK0 = sheet ZDOKS/ZDOK0
harness ZDOK1 = sheet V6_CONFIG_IO_16_17_21_22/ZDOK1
harness ZDOK1 = sheet V6_IO_23_24_25_26/ZDOK1
harness ZDOK1 = sheet ZDOKS/ZDOK1

### Notes on the sheet
- 2009   THIS DOCUMENT IS THE PROPERTY OF THE OWNER, AND MAY NOT BE COPIED OR USED FOR ANY PURPOSE OTHER THAN THAT FOR WHICH IT IS SUPPLIED WITHOUT PERMISSION IN WRITING FROM THE OWNER.
- C
- DATESTAMP OF THIS PRINT
- DRAWN BY:
- DOCUMENT NUMBER:
- SCHEMATIC FILENAME:
- PCB FILENAME:
- ENGINEER:
- APPROVED:
- CIRCUIT DIAGRAM
- DATE
- SHEET
- REVISION
- OF

## Sheet ddr3.SchDoc: Virtex-6 DDR3 DIMM
size A3; Date: DO NOT USE, RATHER USE PROJ OPTIONS; DrawnBy: DO NOT USE, RATHER USE PROJ OPTIONS; Engineer: DO NOT USE, RATHER USE PROJ OPTIONS; Organization: DO NOT USE, RATHER USE PROJ OPTIONS; DocumentNumber: DO NOT USE, RATHER USE PROJ OPTIONS; Revision: DO NOT USE, RATHER USE PROJ OPTIONS; SheetNumber: 21; SheetTotal: 27; SCH_Sheet_Filename: ddr3.SchDoc; CurrentTime: DO NOT USE, RATHER USE PROJ OPTIONS; Time: DO NOT USE, RATHER USE PROJ OPTIONS; DocumentFullPathAndName: DO NOT USE, RATHER USE PROJ OPTIONS; DocumentName: DO NOT USE, RATHER USE PROJ OPTIONS; ModifiedDate: DO NOT USE, RATHER USE PROJ OPTIONS; ImagePath: DO NOT USE, RATHER USE PROJ OPTIONS
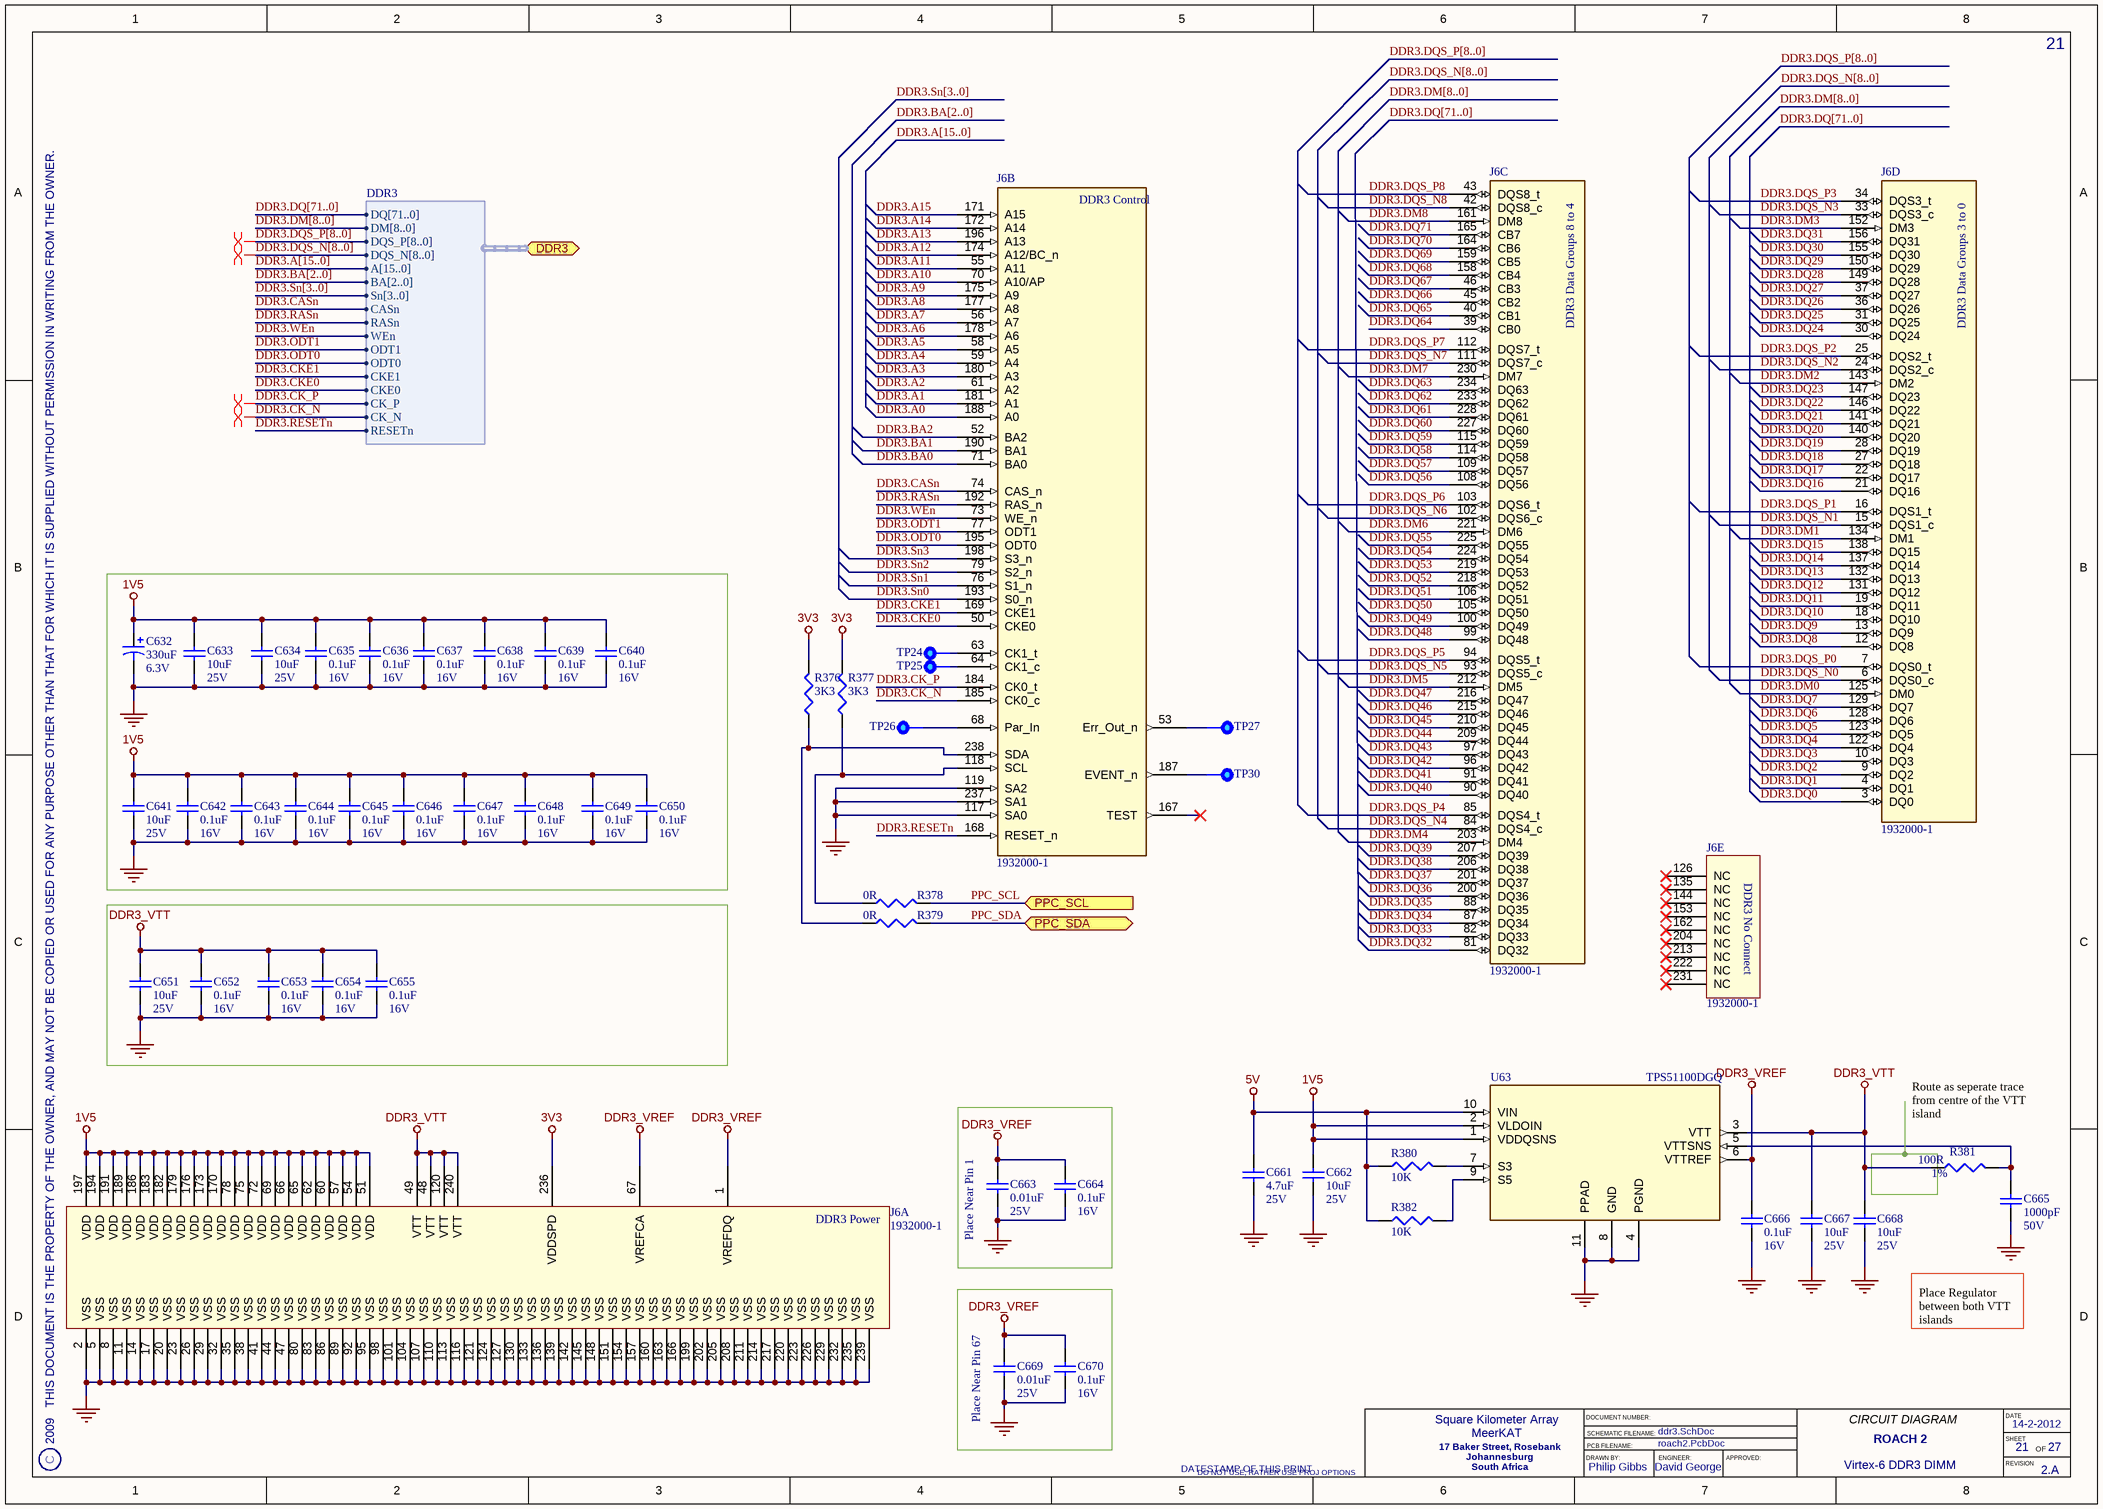
[diagram p2: ddr3.SchDoc]

### Parts
C632  Rating: 6.3V  [CAPMP7343X280L]  (hidden comment: 330uF)
C633  Rating: 25V  [CAPC3225X200L]  (hidden comment: 10uF)
C634  Rating: 25V  [CAPC3225X200L]  (hidden comment: 10uF)
C635  Rating: 16V  [CAPC1005X60L]  (hidden comment: 0.1uF)
C636  Rating: 16V  [CAPC1005X60L]  (hidden comment: 0.1uF)
C637  Rating: 16V  [CAPC1005X60L]  (hidden comment: 0.1uF)
C638  Rating: 16V  [CAPC1005X60L]  (hidden comment: 0.1uF)
C639  Rating: 16V  [CAPC1005X60L]  (hidden comment: 0.1uF)
C640  Rating: 16V  [CAPC1005X60L]  (hidden comment: 0.1uF)
C641  Rating: 25V  [CAPC3225X200L]  (hidden comment: 10uF)
C642  Rating: 16V  [CAPC1005X60L]  (hidden comment: 0.1uF)
C643  Rating: 16V  [CAPC1005X60L]  (hidden comment: 0.1uF)
C644  Rating: 16V  [CAPC1005X60L]  (hidden comment: 0.1uF)
C645  Rating: 16V  [CAPC1005X60L]  (hidden comment: 0.1uF)
C646  Rating: 16V  [CAPC1005X60L]  (hidden comment: 0.1uF)
C647  Rating: 16V  [CAPC1005X60L]  (hidden comment: 0.1uF)
C648  Rating: 16V  [CAPC1005X60L]  (hidden comment: 0.1uF)
C649  Rating: 16V  [CAPC1005X60L]  (hidden comment: 0.1uF)
C650  Rating: 16V  [CAPC1005X60L]  (hidden comment: 0.1uF)
C651  Rating: 25V  [CAPC3225X200L]  (hidden comment: 10uF)
C652  Rating: 16V  [CAPC1005X60L]  (hidden comment: 0.1uF)
C653  Rating: 16V  [CAPC1005X60L]  (hidden comment: 0.1uF)
C654  Rating: 16V  [CAPC1005X60L]  (hidden comment: 0.1uF)
C655  Rating: 16V  [CAPC1005X60L]  (hidden comment: 0.1uF)
C661  Rating: 25V  [CAPC2012X127L]  (hidden comment: 4.7uF)
C662  Rating: 25V  [CAPC3225X200L]  (hidden comment: 10uF)
C663  Rating: 25V  [CAPC1005X55L]  (hidden comment: 0.01uF)
C664  Rating: 16V  [CAPC1005X60L]  (hidden comment: 0.1uF)
C665  Rating: 50V  [CAPC1005X55L]  (hidden comment: 1000pF)
C666  Rating: 16V  [CAPC1005X60L]  (hidden comment: 0.1uF)
C667  Rating: 25V  [CAPC3225X200L]  (hidden comment: 10uF)
C668  Rating: 25V  [CAPC3225X200L]  (hidden comment: 10uF)
C669  Rating: 25V  [CAPC1005X55L]  (hidden comment: 0.01uF)
C670  Rating: 16V  [CAPC1005X60L]  (hidden comment: 0.1uF)
J6  1932000-1  [TYCO_1932000-1]  (parts A,B,C,D,E of 5)
R376  3K3  [RESC1005X40L]
R377  3K3  [RESC1005X40L]
R378  0R  [RESC1005X40L]
R379  0R  [RESC1005X40L]
R380  10K  [RESC1005X40L]
R381  Tolerance: 1%  [RESC1005X40L]  (hidden comment: 100R)
R382  10K  [RESC1005X40L]
TP24  Testpoint  [TP100]  (value not drawn)  (no BOM)
TP25  Testpoint  [TP100]  (value not drawn)  (no BOM)
TP26  Testpoint  [TP100]  (value not drawn)  (no BOM)
TP27  Testpoint  [TP100]  (value not drawn)  (no BOM)
TP30  Testpoint  [TP100]  (value not drawn)  (no BOM)
U63  TPS51100DGQ  [MSOP_10-N]

### Blocks framed on the sheet
Place Near Pin 1: C663 C664
Place Near Pin 67: C669 C670

### Ports
DDR3 (harness DDR3), PPC_SCL (in), PPC_SDA (bidir)

### Harnesses
DDR3: DQ[71..0], DM[8..0], DQS_P[8..0], DQS_N[8..0], A[15..0], BA[2..0], Sn[3..0], CASn, RASn, WEn, ODT1, ODT0, CKE1, CKE0, CK_P, CK_N, RESETn

### Nets
1V5: C632.1 C633.2 C634.2 C635.2 C636.2 C637.2 C638.2 C639.2 C640.2 C641.2 C642.2 C643.2 C644.2 C645.2 C646.2 C647.2 C648.2 C649.2 C650.2 C662.2 J6.51(VDD) J6.54(VDD) J6.57(VDD) J6.60(VDD) J6.62(VDD) J6.65(VDD) J6.66(VDD) J6.69(VDD) J6.72(VDD) J6.75(VDD) J6.78(VDD) J6.170(VDD) J6.173(VDD) J6.176(VDD) J6.179(VDD) J6.182(VDD) J6.183(VDD) J6.186(VDD) J6.189(VDD) J6.191(VDD) J6.194(VDD) J6.197(VDD) U63.1(VDDQSNS) U63.2(VLDOIN)
3V3: J6.236(VDDSPD) R376.2 R377.2
5V: C661.2 R380.1 R382.1 U63.10(VIN)
DDR3_VREF: C663.2 C664.2 C666.2 C669.2 C670.2 J6.1(VREFDQ) J6.67(VREFCA) U63.6(VTTREF)
DDR3_VTT: C651.2 C652.2 C653.2 C654.2 C655.2 C667.2 C668.2 J6.48(VTT) J6.49(VTT) J6.120(VTT) J6.240(VTT) R381.1 U63.3(VTT)
GND: C632.2 C633.1 C634.1 C635.1 C636.1 C637.1 C638.1 C639.1 C640.1 C641.1 C642.1 C643.1 C644.1 C645.1 C646.1 C647.1 C648.1 C649.1 C650.1 C651.1 C652.1 C653.1 C654.1 C655.1 C661.1 C662.1 C663.1 C664.1 C665.1 C666.1 C667.1 C668.1 C669.1 C670.1 J6.2(VSS) J6.5(VSS) J6.8(VSS) J6.11(VSS) J6.14(VSS) J6.17(VSS) J6.20(VSS) J6.23(VSS) J6.26(VSS) J6.29(VSS) J6.32(VSS) J6.35(VSS) J6.38(VSS) J6.41(VSS) J6.44(VSS) J6.47(VSS) J6.80(VSS) J6.83(VSS) J6.86(VSS) J6.89(VSS) J6.92(VSS) J6.95(VSS) J6.98(VSS) J6.101(VSS) J6.104(VSS) J6.107(VSS) J6.110(VSS) J6.113(VSS) J6.116(VSS) J6.117(SA0) J6.119(SA2) J6.121(VSS) J6.124(VSS) J6.127(VSS) J6.130(VSS) J6.133(VSS) J6.136(VSS) J6.139(VSS) J6.142(VSS) J6.145(VSS) J6.148(VSS) J6.151(VSS) J6.154(VSS) J6.157(VSS) J6.160(VSS) J6.163(VSS) J6.166(VSS) J6.199(VSS) J6.202(VSS) J6.205(VSS) J6.208(VSS) J6.211(VSS) J6.214(VSS) J6.217(VSS) J6.220(VSS) J6.223(VSS) J6.226(VSS) J6.229(VSS) J6.232(VSS) J6.235(VSS) J6.237(SA1) J6.239(VSS) U63.4(PGND) U63.8(GND) U63.11(PPAD)
DDR3.A0: J6.188(A0)
DDR3.A1: J6.181(A1)
DDR3.A2: J6.61(A2)
DDR3.A3: J6.180(A3)
DDR3.A4: J6.59(A4)
DDR3.A5: J6.58(A5)
DDR3.A6: J6.178(A6)
DDR3.A7: J6.56(A7)
DDR3.A8: J6.177(A8)
DDR3.A9: J6.175(A9)
DDR3.A10: J6.70(A10/AP)
DDR3.A11: J6.55(A11)
DDR3.A12: J6.174(A12/BC_n)
DDR3.A13: J6.196(A13)
DDR3.A14: J6.172(A14)
DDR3.A15: J6.171(A15)
DDR3.BA0: J6.71(BA0)
DDR3.BA1: J6.190(BA1)
DDR3.BA2: J6.52(BA2)
DDR3.CASn: J6.74(CAS_n) ; port DDR3.CASn
DDR3.CK_N: J6.185(CK0_c) ; port DDR3.CK_N
DDR3.CK_P: J6.184(CK0_t) ; port DDR3.CK_P
DDR3.CKE0: J6.50(CKE0) ; port DDR3.CKE0
DDR3.CKE1: J6.169(CKE1) ; port DDR3.CKE1
DDR3.DM0: J6.125(DM0)
DDR3.DM1: J6.134(DM1)
DDR3.DM2: J6.143(DM2)
DDR3.DM3: J6.152(DM3)
DDR3.DM4: J6.203(DM4)
DDR3.DM5: J6.212(DM5)
DDR3.DM6: J6.221(DM6)
DDR3.DM7: J6.230(DM7)
DDR3.DM8: J6.161(DM8)
DDR3.DQ0: J6.3(DQ0)
DDR3.DQ1: J6.4(DQ1)
DDR3.DQ2: J6.9(DQ2)
DDR3.DQ3: J6.10(DQ3)
DDR3.DQ4: J6.122(DQ4)
DDR3.DQ5: J6.123(DQ5)
DDR3.DQ6: J6.128(DQ6)
DDR3.DQ7: J6.129(DQ7)
DDR3.DQ8: J6.12(DQ8)
DDR3.DQ9: J6.13(DQ9)
DDR3.DQ10: J6.18(DQ10)
DDR3.DQ11: J6.19(DQ11)
DDR3.DQ12: J6.131(DQ12)
DDR3.DQ13: J6.132(DQ13)
DDR3.DQ14: J6.137(DQ14)
DDR3.DQ15: J6.138(DQ15)
DDR3.DQ16: J6.21(DQ16)
DDR3.DQ17: J6.22(DQ17)
DDR3.DQ18: J6.27(DQ18)
DDR3.DQ19: J6.28(DQ19)
DDR3.DQ20: J6.140(DQ20)
DDR3.DQ21: J6.141(DQ21)
DDR3.DQ22: J6.146(DQ22)
DDR3.DQ23: J6.147(DQ23)
DDR3.DQ24: J6.30(DQ24)
DDR3.DQ25: J6.31(DQ25)
DDR3.DQ26: J6.36(DQ26)
DDR3.DQ27: J6.37(DQ27)
DDR3.DQ28: J6.149(DQ28)
DDR3.DQ29: J6.150(DQ29)
DDR3.DQ30: J6.155(DQ30)
DDR3.DQ31: J6.156(DQ31)
DDR3.DQ32: J6.81(DQ32)
DDR3.DQ33: J6.82(DQ33)
DDR3.DQ34: J6.87(DQ34)
DDR3.DQ35: J6.88(DQ35)
DDR3.DQ36: J6.200(DQ36)
DDR3.DQ37: J6.201(DQ37)
DDR3.DQ38: J6.206(DQ38)
DDR3.DQ39: J6.207(DQ39)
DDR3.DQ40: J6.90(DQ40)
DDR3.DQ41: J6.91(DQ41)
DDR3.DQ42: J6.96(DQ42)
DDR3.DQ43: J6.97(DQ43)
DDR3.DQ44: J6.209(DQ44)
DDR3.DQ45: J6.210(DQ45)
DDR3.DQ46: J6.215(DQ46)
DDR3.DQ47: J6.216(DQ47)
DDR3.DQ48: J6.99(DQ48)
DDR3.DQ49: J6.100(DQ49)
DDR3.DQ50: J6.105(DQ50)
DDR3.DQ51: J6.106(DQ51)
DDR3.DQ52: J6.218(DQ52)
DDR3.DQ53: J6.219(DQ53)
DDR3.DQ54: J6.224(DQ54)
DDR3.DQ55: J6.225(DQ55)
DDR3.DQ56: J6.108(DQ56)
DDR3.DQ57: J6.109(DQ57)
DDR3.DQ58: J6.114(DQ58)
DDR3.DQ59: J6.115(DQ59)
DDR3.DQ60: J6.227(DQ60)
DDR3.DQ61: J6.228(DQ61)
DDR3.DQ62: J6.233(DQ62)
DDR3.DQ63: J6.234(DQ63)
DDR3.DQ64: J6.39(CB0)
DDR3.DQ65: J6.40(CB1)
DDR3.DQ66: J6.45(CB2)
DDR3.DQ67: J6.46(CB3)
DDR3.DQ68: J6.158(CB4)
DDR3.DQ69: J6.159(CB5)
DDR3.DQ70: J6.164(CB6)
DDR3.DQ71: J6.165(CB7)
DDR3.DQS_N0: J6.6(DQS0_c)
DDR3.DQS_N1: J6.15(DQS1_c)
DDR3.DQS_N2: J6.24(DQS2_c)
DDR3.DQS_N3: J6.33(DQS3_c)
DDR3.DQS_N4: J6.84(DQS4_c)
DDR3.DQS_N5: J6.93(DQS5_c)
DDR3.DQS_N6: J6.102(DQS6_c)
DDR3.DQS_N7: J6.111(DQS7_c)
DDR3.DQS_N8: J6.42(DQS8_c)
DDR3.DQS_P0: J6.7(DQS0_t)
DDR3.DQS_P1: J6.16(DQS1_t)
DDR3.DQS_P2: J6.25(DQS2_t)
DDR3.DQS_P3: J6.34(DQS3_t)
DDR3.DQS_P4: J6.85(DQS4_t)
DDR3.DQS_P5: J6.94(DQS5_t)
DDR3.DQS_P6: J6.103(DQS6_t)
DDR3.DQS_P7: J6.112(DQS7_t)
DDR3.DQS_P8: J6.43(DQS8_t)
DDR3.ODT0: J6.195(ODT0) ; port DDR3.ODT0
DDR3.ODT1: J6.77(ODT1) ; port DDR3.ODT1
DDR3.RASn: J6.192(RAS_n) ; port DDR3.RASn
DDR3.RESETn: J6.168(RESET_n) ; port DDR3.RESETn
DDR3.Sn0: J6.193(S0_n)
DDR3.Sn1: J6.76(S1_n)
DDR3.Sn2: J6.79(S2_n)
DDR3.Sn3: J6.198(S3_n)
DDR3.WEn: J6.73(WE_n) ; port DDR3.WEn
PPC_SCL: R378.2 ; port PPC_SCL
PPC_SDA: R379.2 ; port PPC_SDA
NetC665_2: C665.2 R381.2 U63.5(VTTSNS)
NetJ6_53: J6.53(Err_Out_n) TP27.1
NetJ6_63: J6.63(CK1_t) TP24.1
NetJ6_64: J6.64(CK1_c) TP25.1
NetJ6_68: J6.68(Par_In) TP26.1
NetJ6_118: J6.118(SCL) R377.1 R378.1
NetJ6_187: J6.187(EVENT_n) TP30.1
NetJ6_238: J6.238(SDA) R376.1 R379.1
NetR380_2: R380.2 U63.7(S3)
NetR382_2: R382.2 U63.9(S5)

Not connected (* = marked no-connect by the designer): J6 126(NC)* 135(NC)* 144(NC)* 153(NC)* 162(NC)* 167(TEST)* 204(NC)* 213(NC)* 222(NC)* 231(NC)*

### Buses and harness runs
bus DDR3.A[15..0]
bus DDR3.BA[2..0]
bus DDR3.DM[8..0]
bus DDR3.DQ[71..0]
bus DDR3.DQS_N[8..0]
bus DDR3.DQS_P[8..0]
bus DDR3.Sn[3..0]

### Layout directives
differential pair: (no net found under the mark), DDR3.CK_N, DDR3.CK_P

### Notes on the sheet
- Route as seperate trace from centre of the VTT island
- Place Regulator between both VTT islands
- 2009   THIS DOCUMENT IS THE PROPERTY OF THE OWNER, AND MAY NOT BE COPIED OR USED FOR ANY PURPOSE OTHER THAN THAT FOR WHICH IT IS SUPPLIED WITHOUT PERMISSION IN WRITING FROM THE OWNER.
- C
- DATESTAMP OF THIS PRINT
- DRAWN BY:
- DOCUMENT NUMBER:
- SCHEMATIC FILENAME:
- PCB FILENAME:
- ENGINEER:
- APPROVED:
- CIRCUIT DIAGRAM
- DATE
- SHEET
- REVISION
- OF
- (in symbol CONN-PCB-3, part A) DDR3 Power
- (in symbol CONN-PCB-3, part B) DDR3 Control
- (in symbol CONN-PCB-3, part C) DDR3 Data Groups 8 to 4
- (in symbol CONN-PCB-3, part D) DDR3 Data Groups 3 to 0
- (in symbol CONN-PCB-3, part E) DDR3 No Connect

### Library data of the parts
C632 = CAP-TAN-2: 330uF, Conductive Polymer Chip Capacitor; Manufacturer: KEMET; PartNum: T520D337M006ATE045; Tolerance: 20%; ESR: 0.05; POD number: CAP-TAN-2; Value: 330uF; RoHS: Y; Sort Value: 330; Category: Capacitors; Subcategory: Tantalum
C633 C634 C641 C651 C662 C667 C668 = CAP-CER-5: 10uF, Ceramic Capacitor; Manufacturer: MURATA; PartNum: GRM32DR61E106KA12L; Tolerance: 10%; Dielectric: X5R; POD number: CAP-CER-5; Value: 10uF; RoHS: Y; Sort Value: 100; Category: Capacitors; Subcategory: Ceramic
C635-C640 C642-C650 C652-C655 C664 C666 C670 = CAP-CER-1: as C493 on sheet hwmon_2; POD number: CAP-CER-1; Value: 0.1uF; RoHS: Y; Sort Value: 0.1; Category: Capacitors; Subcategory: Ceramic
C661 = CAP-CER-3: 4.7uF, Ceramic Capacitor; Manufacturer: MURATA; PartNum: GRM21BR61E475KA12K; Tolerance: 10%; Dielectric: X5R; POD number: CAP-CER-3; Value: 4.7uF; RoHS: Y; Sort Value: 4.7; Category: Capacitors; Subcategory: Ceramic
C663 C669 = CAP-CER-6: 0.01uF, Ceramic Capacitor; Manufacturer: MURATA; PartNum: GRM155R71E103KA01D; Tolerance: 10%; Dielectric: X7R; POD number: CAP-CER-6; Value: 0.01uF; RoHS: Y; Sort Value: 0.01; Category: Capacitors; Subcategory: Ceramic
C665 = CAP-CER-4: 1000pF, Ceramic Capacitor; Manufacturer: MURATA; PartNum: GRM155R61H102KA01D; Tolerance: 10%; Dielectric: X5R; POD number: CAP-CER-4; Value: 1000pF; RoHS: Y; Sort Value: 0.0001; Category: Capacitors; Subcategory: Ceramic
J6 = CONN-PCB-3: 240-pin DDR3 DIMM Socket; Manufacturer: TYCO; POD number: CONN-PCB-3; PartNum: 1932000-1; RoHS: Y; Category: CONN; Subcategory: PCB
R376 R377 = RES-TF-7: 3K3, 1.1mm x 0.5mm, Thick Film Resistor; Manufacturer: ROYALOHM; PartNum: 0402WGJ0332T1E; Tolerance: 5%; Rating: 0.0625W; POD number: RES-TF-7; Value: 3K3; Sort Value: 3300; Category: Resistors; Subcategory: ThickFilm; HelpURL: *.pdf
R378 R379 = RES-TF-0: 0R, 1.1mm x 0.5mm, Thick Film Resistor; Manufacturer: ROYALOHM; PartNum: 0402WG00000T1E; Tolerance: 0%; Rating: 0.0625W; POD number: RES-TF-0; Value: 0R; Sort Value: 0; Category: Resistors; Subcategory: ThickFilm; HelpURL: *.pdf
R380 R382 = RES-TF-5: as R32 on sheet hwmon_2; POD number: RES-TF-5; Value: 10K; Sort Value: 10000; Category: Resistors; Subcategory: ThickFilm; HelpURL: *.pdf
R381 = RES-TF-14: 100R, 1.1mm x 0.5mm, Thick Film Resistor; Manufacturer: ROYALOHM; PartNum: 0402WGF0101T1E; Rating: 0.0625W; POD number: RES-TF-14; Value: 100R; Sort Value: 1000; Category: Resistors; Subcategory: ThickFilm; HelpURL: *.pdf
TP24-TP27 TP30 = ELMECH-TP-0: 1mm Diameter, through-hole, Circular Test-point; POD number: ELMECH-TP-0; RoHS: Y; Category: ELMECH; Subcategory: Test Points
U63 = IC-REG-6: 3A Sink/Source Regulator; Manufacturer: Texas Instruments; POD number: IC-REG-6; PartNum: TPS51100DGQ; RoHS: Y; Category: IC; Subcategory: Regulators